# Altium schematic sheet shematic_full_v0.SchDoc
size 152 x 152 mm; ApprovedBy: ME; Author: X; Address1: 0; DocumentFullPathAndName: X
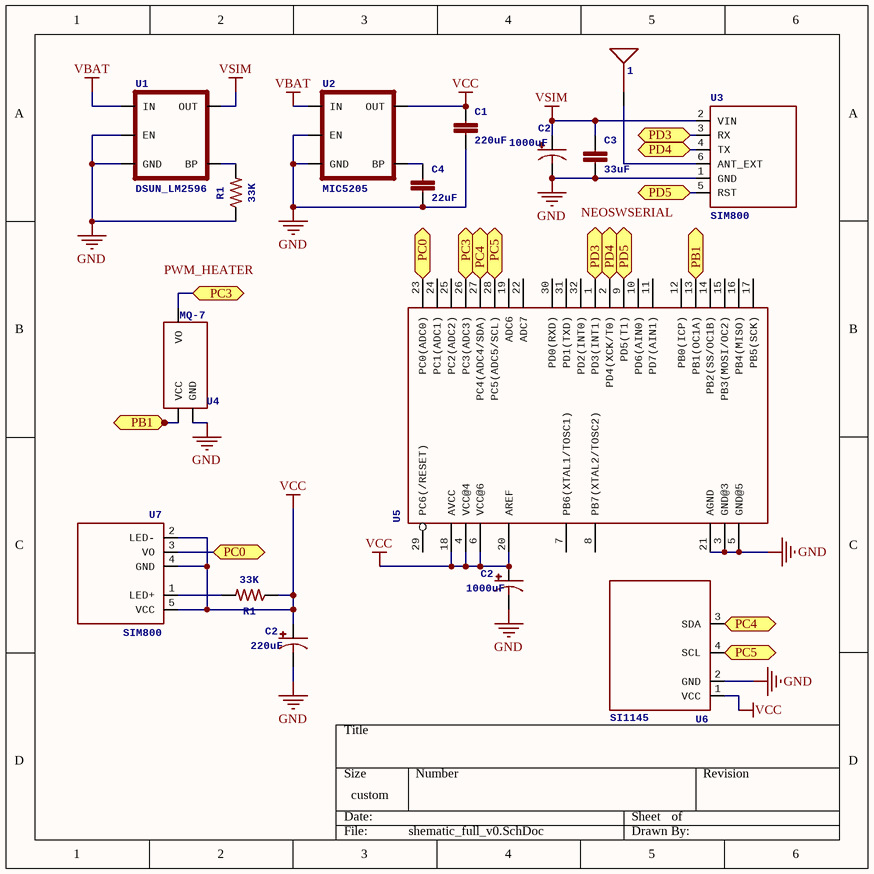
[diagram p0: shematic_full_v0.SchDoc]

## Parts
(Parts that share a designator on the sheet are numbered #1, #2 ... from top to bottom, then left to right.)
1  (no value)  [ANT-2.4GHZ-6.5X2.2MM]
C1  220uF  [0402]
C2#1  1000uF  [CPOL-RADIAL-5MM-10MM]
C2#2  1000uF  [CPOL-RADIAL-5MM-10MM]
C2#3  220uF  [CPOL-RADIAL-5MM-10MM]
C3  33uF  [0402]
C4  22uF  [0402]
R1#1  33K  [0402]
R1#2  33K  [0402]
U1  DSUN_LM2596  [SOT23-5]
U2  MIC5205  [SOT23-5]
U3  SIM800  [JST-6PIN-1MM]
U4  MQ-7  [SOT23-3]
U5  (no value)  [TQFP32-08]
U6  SI1145  [GP3906-TLP]
U7  SIM800  [JST-6PIN-1MM]

## Ports
PB1, PC0, PC3, PC4, PC5, PD3, PD4, PD5

## Nets
GND: C1.2 C2#1.- C2#2.- C2#3.- C3.2 C4.2 R1#1.1 U1.2(GND) U1.3(EN) U2.2(GND) U2.3(EN) U3.1(GND) U4.3(GND) U5.3(GND@3) U5.5(GND@5) U5.21(AGND) U6.2(GND)
VBAT: U1.1(IN) U2.1(IN)
VCC: C1.1 C2#2.+ C2#3.+ R1#2.1 U2.5(OUT) U5.4(VCC@4) U5.6(VCC@6) U5.18(AVCC) U5.20(AREF) U6.1(VCC) U7.2(LED-) U7.4(GND) U7.5(VCC)
VSIM: C2#1.+ C3.1 U1.5(OUT) U3.2(VIN)
PB1: U4.1(VCC) U5.13(PB1(OC1A)) ; port PB1
PC0: U5.23(PC0(ADC0)) U7.3(VO) ; port PC0
PC3: U4.2(VO) U5.26(PC3(ADC3)) ; port PC3
PC4: U5.27(PC4(ADC4/SDA)) U6.3(SDA) ; port PC4
PC5: U5.28(PC5(ADC5/SCL)) U6.4(SCL) ; port PC5
PD3: U3.3(RX) U5.1(PD3(INT1)) ; port PD3
PD4: U3.4(TX) U5.2(PD4(XCK/T0)) ; port PD4
PD5: U3.5(RST) U5.9(PD5(T1)) ; port PD5
Net1_FEED: 1.FEED(SIGNAL) U3.6(ANT_EXT)
NetC4_1: C4.1 U2.4(BP)
NetR1#1_2: R1#1.2 U1.4(BP)
NetR1#2_2: R1#2.2 U7.1(LED+)

Not connected (* = marked no-connect by the designer): U5 7(PB6(XTAL1/TOSC1)) 8(PB7(XTAL2/TOSC2)) 10(PD6(AIN0)) 11(PD7(AIN1)) 12(PB0(ICP)) 14(PB2(SS/OC1B)) 15(PB3(MOSI/OC2)) 16(PB4(MISO)) 17(PB5(SCK)) 19(ADC6) 22(ADC7) 24(PC1(ADC1)) 25(PC2(ADC2)) 29(PC6(/RESET)) 30(PD0(RXD)) 31(PD1(TXD)) 32(PD2(INT0))

## Notes on the sheet
- Labels drawn without touching a wire or pin: NEOSWSERIAL, PWM_HEATER

## Library data of the parts
1 = ANTENNA2.4GHZ-6.5X2.2MM: PROD_ID: ANT-08187; SF_ID: WRL-00144
C1 C3 C4 = 0.1UF-0402-16V-10%: PROD_ID: CAP-12416
C2#1-C2#3 = 1000UF-RADIAL-5MM-25V-20%: PROD_ID: CAP-09538
R1#1 R1#2 = RESISTOR0402
U1 U2 = V_REG_MIC5205ADJ: PROD_ID: VREG-12594
U3 U7 = EM-506-VERTICAL: PROD_ID: CONN-08249
U4 = MCP9700TT: PROD_ID: IC-08917
U5 = ATMEGA328P_TQFP: PROD_ID: IC-09069
U6 = GP3906-TLP: PROD_ID: GPS-13174